# EAGLE schematic commutator (EAGLE 7.2.0)

## Sheet 1 of 2
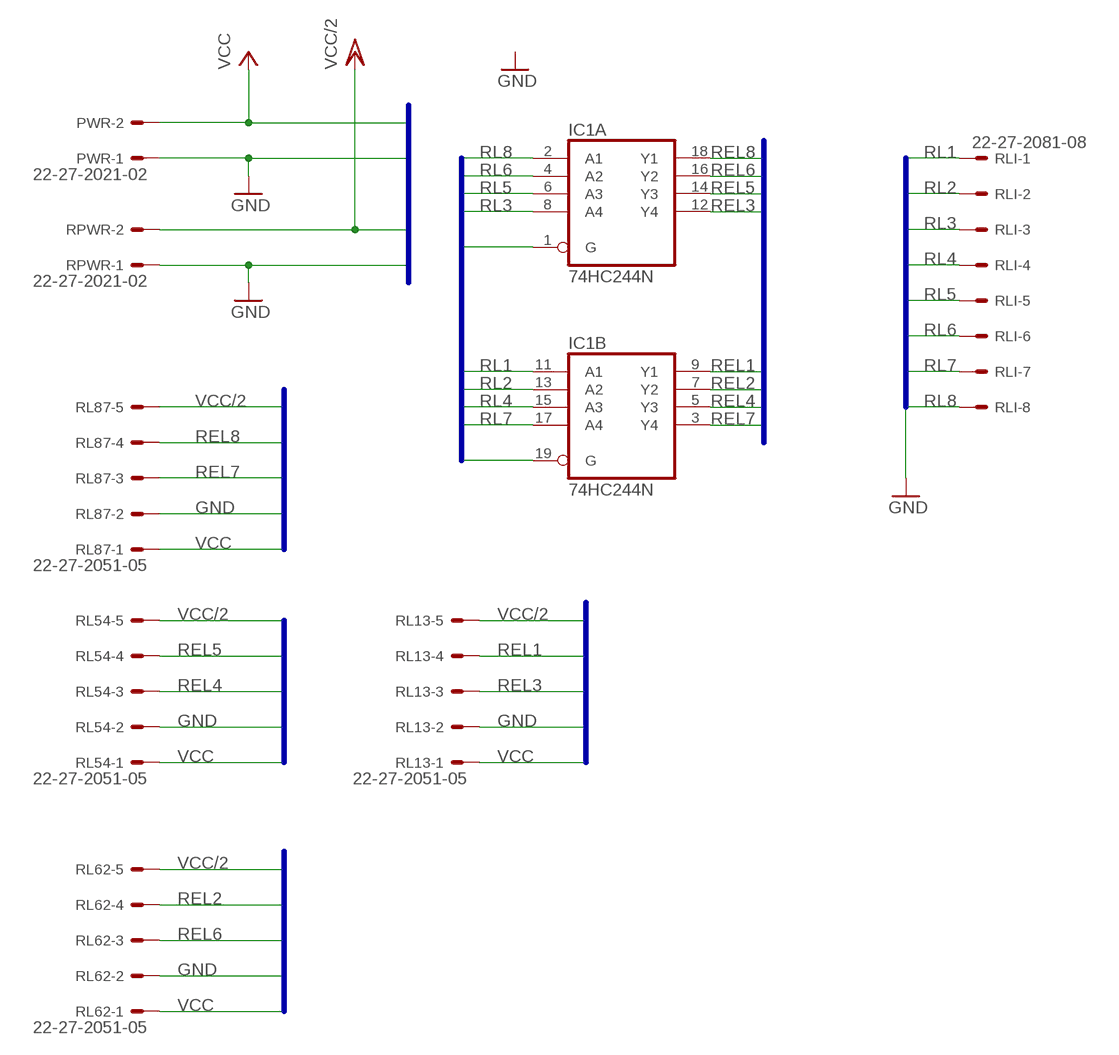
[diagram p0: schematic, sheet 1]

### Parts
IC1  74HC244N  [DIL20]
PWR  22-27-2021-02  [6410-02]
RL13  22-27-2051-05  [6410-05]
RL54  22-27-2051-05  [6410-05]
RL62  22-27-2051-05  [6410-05]
RL87  22-27-2051-05  [6410-05]
RLI  22-27-2081-08  [6410-08]
RPWR  22-27-2021-02  [6410-02]

### Nets
GND: IC1.1(A:G) IC1.19(B:G) PWR.1 RL13.2 RL54.2 RL62.2 RL87.2 RPWR.1 ; also sheet 2
REL1: IC1.9(B:Y1) RL13.4
REL2: IC1.7(B:Y2) RL62.4
REL3: IC1.12(A:Y4) RL13.3
REL4: IC1.5(B:Y3) RL54.3
REL5: IC1.14(A:Y3) RL54.4
REL6: IC1.16(A:Y2) RL62.3
REL7: IC1.3(B:Y4) RL87.3
REL8: IC1.18(A:Y1) RL87.4
RL1: IC1.11(B:A1) RLI.1
RL2: IC1.13(B:A2) RLI.2
RL3: IC1.8(A:A4) RLI.3
RL4: IC1.15(B:A3) RLI.4
RL5: IC1.6(A:A3) RLI.5
RL6: IC1.4(A:A2) RLI.6
RL7: IC1.17(B:A4) RLI.7
RL8: IC1.2(A:A1) RLI.8
VCC: PWR.2 RL13.1 RL54.1 RL62.1 RL87.1 ; also sheet 2
VCC/2 [VCC/2]: RL13.5 RL54.5 RL62.5 RL87.5 RPWR.2

### Buses
RL1,RL2,RL3,RL4,RL5,RL6,RL7,RL8,GND
VCC,VCC/2,GND
REL1,REL2,REL3,REL4,REL5,REL6,REL7,REL8,VCC,VCC/2,GND
REL7,REL8,VCC,VCC/2,GND
VCC,VCC/2,GND,REL4,REL5
VCC,VCC/2,GND,REL6,REL2
VCC,VCC/2,GND,REL1,REL3

## Sheet 2 of 2
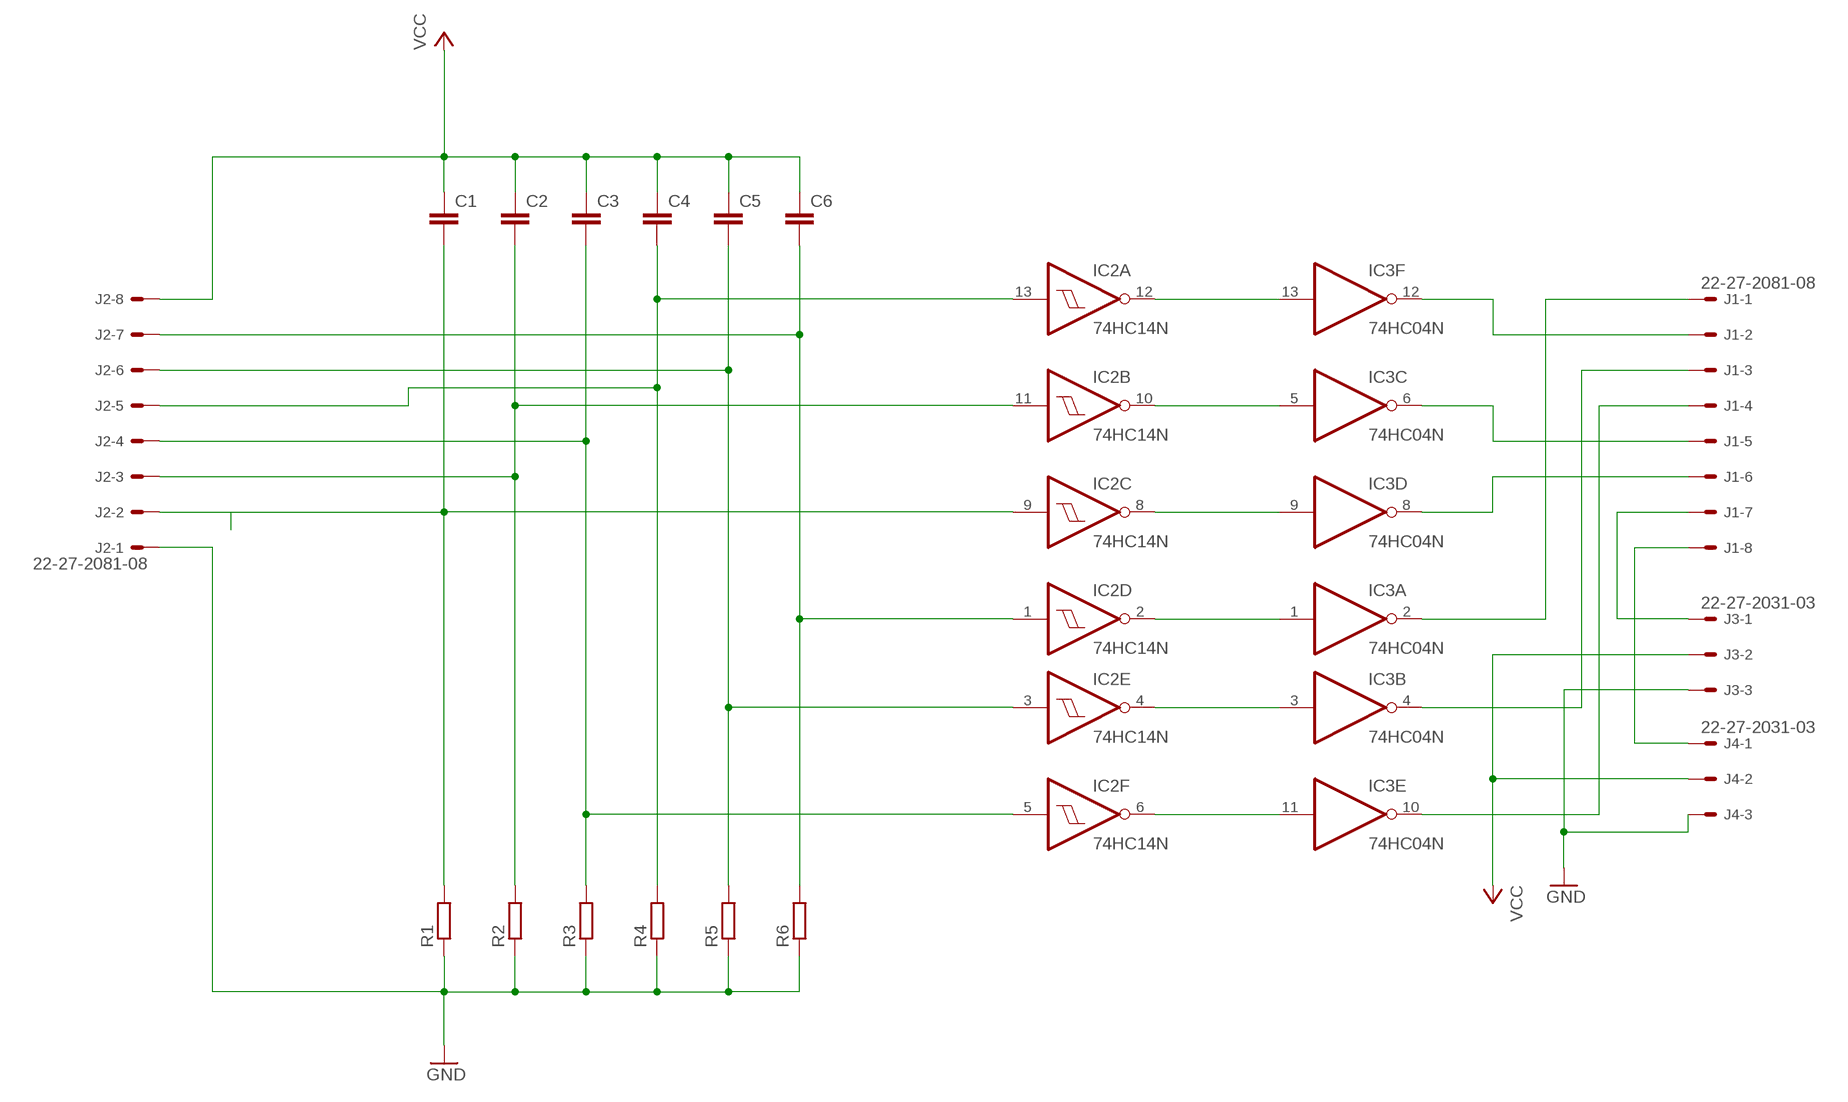
[diagram p1: schematic, sheet 2]

### Parts
C1  C-EU050-024X044  [C050-024X044]
C2  C-EU050-024X044  [C050-024X044]
C3  C-EU050-024X044  [C050-024X044]
C4  C-EU050-024X044  [C050-024X044]
C5  C-EU050-024X044  [C050-024X044]
C6  C-EU050-024X044  [C050-024X044]
IC2  74HC14N  [DIL14]
IC3  74HC04N  [DIL14]
J1  22-27-2081-08  [6410-08]
J2  22-27-2081-08  [6410-08]
J3  22-27-2031-03  [6410-03]
J4  22-27-2031-03  [6410-03]
R1  R-EU_0207/15  [0207/15]
R2  R-EU_0207/15  [0207/15]
R3  R-EU_0207/15  [0207/15]
R4  R-EU_0207/15  [0207/15]
R5  R-EU_0207/15  [0207/15]
R6  R-EU_0207/15  [0207/15]

### Nets
GND: J2.1 J3.3 J4.3 R1.1 R2.1 R3.1 R4.1 R5.1 R6.1 ; also sheet 1
N$1: IC2.12(A:O) IC3.13(F:I)
N$2: IC2.10(B:O) IC3.5(C:I)
N$3: IC2.8(C:O) IC3.9(D:I)
N$4: IC2.2(D:O) IC3.1(A:I)
N$5: IC2.4(E:O) IC3.3(B:I)
N$6: IC2.6(F:O) IC3.11(E:I)
N$7: IC3.2(A:O) J1.1
N$8: IC3.12(F:O) J1.2
N$9: IC3.4(B:O) J1.3
N$10: IC3.10(E:O) J1.4
N$11: IC3.6(C:O) J1.5
N$12: IC3.8(D:O) J1.6
N$13: C1.2 IC2.9(C:I) J2.2 R1.2
N$14: C2.2 IC2.11(B:I) J2.3 R2.2
N$15: C3.2 IC2.5(F:I) J2.4 R3.2
N$16: C4.2 IC2.13(A:I) J2.5 R4.2
N$17: C5.2 IC2.3(E:I) J2.6 R5.2
N$18: C6.2 IC2.1(D:I) J2.7 R6.2
N$20: J1.7 J3.1
N$21: J1.8 J4.1
VCC: C1.1 C2.1 C3.1 C4.1 C5.1 C6.1 J2.8 J3.2 J4.2 ; also sheet 1

## Power pins joined to a net without a drawn wire
GND: IC1.10(P:GND) IC2.7(P:GND) IC3.7(P:GND)
VCC: IC1.20(P:VCC) IC2.14(P:VCC) IC3.14(P:VCC)

## Library data of the parts
C1-C6 = rcl:C-EU: CAPACITOR, European symbol
IC1 = 74xx-eu:74*244: Octal BUFFER and LINE DRIVER, 3-state
IC2 = 74xx-eu:74*14: Hex schmitt trigger INVERTER
IC3 = 74xx-eu:74*04: Hex INVERTER
J1 J2 RLI = con-molex:22-?-08: CONNECTOR wire to board 2.54 mm (.1 inch) pitch header; OC_FARNELL: unknown; OC_NEWARK: unknown
J3 J4 = con-molex:22-?-03: CONNECTOR wire to board 2.54 mm (.1 inch) pitch header; OC_FARNELL: unknown; OC_NEWARK: unknown
PWR RPWR = con-molex:22-?-02: CONNECTOR wire to board 2.54 mm (.1 inch) pitch header; OC_FARNELL: unknown; OC_NEWARK: unknown
R1-R6 = rcl:R-EU_: RESISTOR, European symbol
RL13 RL54 RL62 RL87 = con-molex:22-?-05: CONNECTOR wire to board 2.54 mm (.1 inch) pitch header; OC_FARNELL: unknown; OC_NEWARK: unknown

## Net classes
1 VCC/2: width 1.143 mm